# EAGLE design NeuWatch (EAGLE 7.2.0)

## Sheet 1 of 3
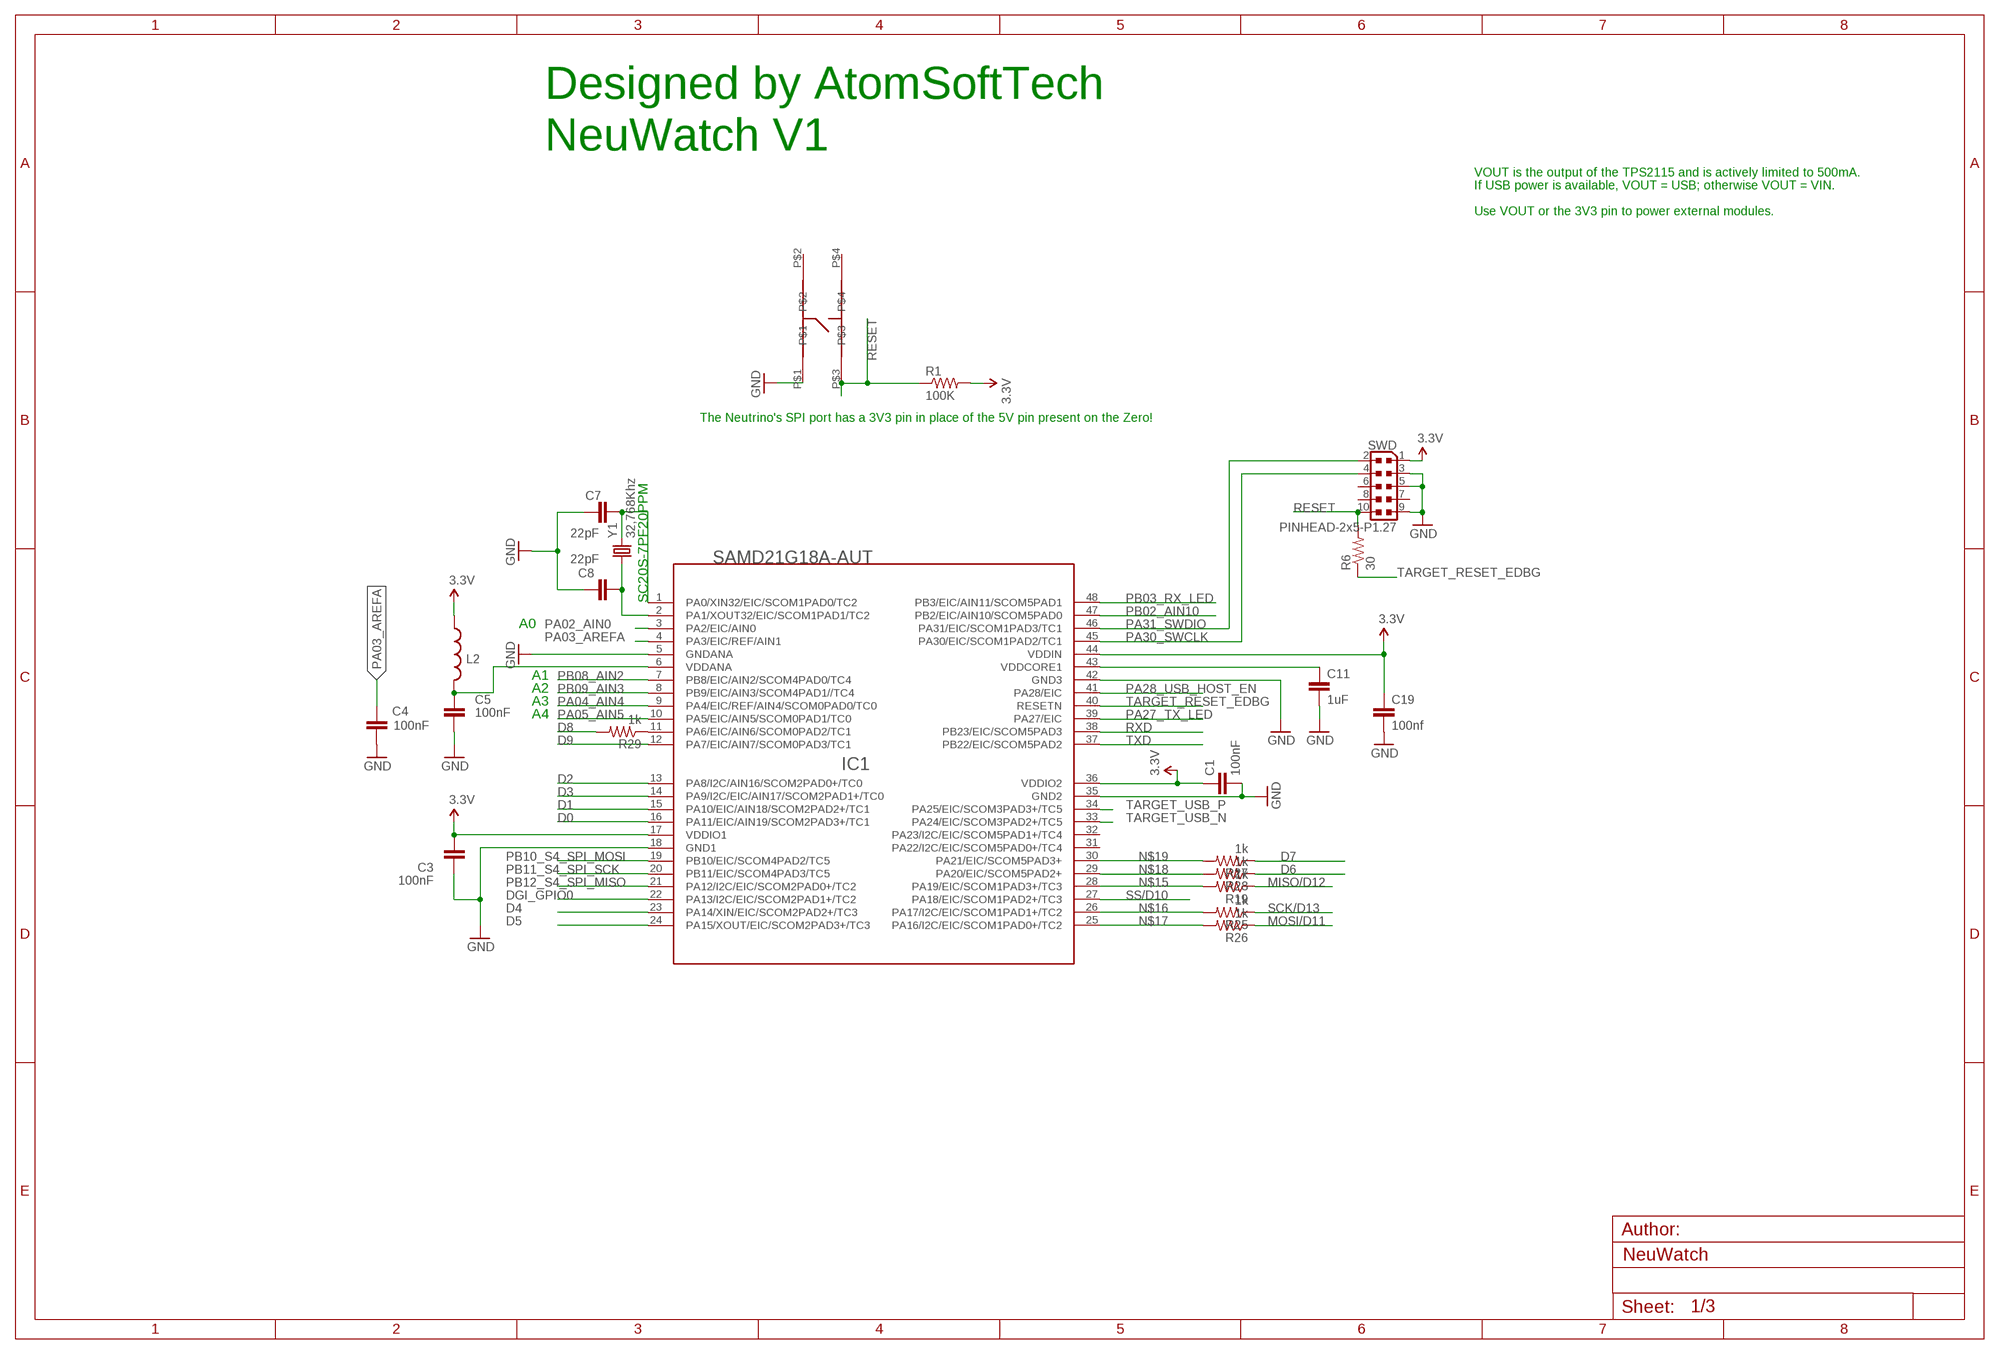
[diagram p0: schematic, sheet 1]

### Parts
C1  100nF  CAPACITORC0402  [C0402]
C3  100nF  CAPACITORC0402  [C0402]
C4  100nF  CAPACITORC0402  [C0402]
C5  100nF  CAPACITORC0402  [C0402]
C7  22pF  CAPACITORC0402  [C0402]
C8  22pF  CAPACITORC0402  [C0402]
C11  1uF  CAPACITORC0402  [C0402]
C19  100nf  CAPACITORC0402  [C0402]
IC1  SAMD21G18A-AUT  INTEGRATEDCIRCUITS_1792_SAMD21G18A-AUT  [INTEGRATEDCIRCUITS_TQFP48-7X7]
L2  INDUCTOR0603-TDK  [0603-TDK]
R1  100K  R-US_R0402  [R0402]
R6  30  R-US_R0402  [R0402]
R19  1k  R-US_R0402  [R0402]
R25  1k  R-US_R0402  [R0402]
R26  1k  R-US_R0402  [R0402]
R27  1k  R-US_R0402  [R0402]
R28  1k  R-US_R0402  [R0402]
R29  1k  R-US_R0402  [R0402]
RESET  TACTILE_SWITCH  [PTS540]
SWD  PINHEAD-2x5-P1.27  ARDUINO-NEUTRINO-082_CONNETTORI_0171_PH127-205DF055G00A  [ARDUINO-NEUTRINO-082_CONNETTORI_PINHEAD-2X5-P127]
Y1  32,768Khz  CRYSTAL2012  [CRYSTAL-SMD-2.0X1.2]

### Nets
3.3V: C1.1 C3.2 C19.1 IC1.17(VDDIO1) IC1.36(VDDIO2) IC1.44(VDDIN) L2.1 R1.2 SWD.1 ; also sheet 2,3
D0: IC1.16(PA11/EIC/AIN19/SCOM2PAD3+/TC1) ; also sheet 3
D1: IC1.15(PA10/EIC/AIN18/SCOM2PAD2+/TC1) ; also sheet 3
D2: IC1.13(PA8/I2C/AIN16/SCOM2PAD0+/TC0) ; also sheet 3
D3: IC1.14(PA9/I2C/EIC/AIN17/SCOM2PAD1+/TC0) ; also sheet 3
D4: IC1.23(PA14/XIN/EIC/SCOM2PAD2+/TC3) ; also sheet 3
D5: IC1.24(PA15/XOUT/EIC/SCOM2PAD3+/TC3) ; also sheet 3
D6: R28.1 ; also sheet 3
D7: R27.1 ; also sheet 3
D8: R29.2 ; also sheet 3
D9: IC1.12(PA7/EIC/AIN7/SCOM0PAD3/TC1) ; also sheet 3
DGI_GPIO0: IC1.22(PA13/I2C/EIC/SCOM2PAD1+/TC2)
GND [gnd]: C1.2 C3.1 C4.2 C5.2 C7.1 C8.1 C11.2 C19.2 IC1.5(GNDANA) IC1.18(GND1) IC1.35(GND2) IC1.42(GND3) RESET.P$1 SWD.3 SWD.5 SWD.9 ; also sheet 2,3
MISO/D12: R19.1 ; also sheet 3
MOSI/D11: R26.1 ; also sheet 3
N$15: IC1.28(PA19/EIC/SCOM1PAD3+/TC3) R19.2
N$16: IC1.26(PA17/I2C/EIC/SCOM1PAD1+/TC2) R25.2
N$17: IC1.25(PA16/I2C/EIC/SCOM1PAD0+/TC2) R26.2
N$18: IC1.29(PA20/EIC/SCOM5PAD2+) R28.2
N$19: IC1.30(PA21/EIC/SCOM5PAD3+) R27.2
N$20: IC1.11(PA6/EIC/AIN6/SCOM0PAD2/TC1) R29.1
PA00_XIN32: C7.2 IC1.1(PA0/XIN32/EIC/SCOM1PAD0/TC2) Y1.2
PA01_XOUT32: C8.2 IC1.2(PA1/XOUT32/EIC/SCOM1PAD1/TC2) Y1.1
PA02_AIN0: IC1.3(PA2/EIC/AIN0) ; also sheet 3
PA03_AREFA: C4.1 IC1.4(PA3/EIC/REF/AIN1)
PA04_AIN4: IC1.9(PA4/EIC/REF/AIN4/SCOM0PAD0/TC0) ; also sheet 3
PA05_AIN5: IC1.10(PA5/EIC/AIN5/SCOM0PAD1/TC0) ; also sheet 3
PA27_TX_LED: IC1.39(PA27/EIC)
PA28_USB_HOST_EN: IC1.41(PA28/EIC) ; also sheet 2
PA30_SWCLK: IC1.45(PA30/EIC/SCOM1PAD2/TC1) SWD.4
PA31_SWDIO: IC1.46(PA31/EIC/SCOM1PAD3/TC1) SWD.2
PB02_AIN10: IC1.47(PB2/EIC/AIN10/SCOM5PAD0) ; also sheet 3
PB03_RX_LED: IC1.48(PB3/EIC/AIN11/SCOM5PAD1)
PB08_AIN2: IC1.7(PB8/EIC/AIN2/SCOM4PAD0/TC4) ; also sheet 3
PB09_AIN3: IC1.8(PB9/EIC/AIN3/SCOM4PAD1//TC4) ; also sheet 3
PB10_S4_SPI_MOSI: IC1.19(PB10/EIC/SCOM4PAD2/TC5)
PB11_S4_SPI_SCK: IC1.20(PB11/EIC/SCOM4PAD3/TC5)
PB12_S4_SPI_MISO: IC1.21(PA12/I2C/EIC/SCOM2PAD0+/TC2)
RESET: R1.1 R6.2 RESET.P$3 SWD.10
RXD: IC1.38(PB23/EIC/SCOM5PAD3)
SCK/D13: R25.1 ; also sheet 3
SS/D10: IC1.27(PA18/EIC/SCOM1PAD2+/TC3) ; also sheet 3
TARGET_RESET_EDBG: IC1.40(RESETN) R6.1
TARGET_USB_N: IC1.33(PA24/EIC/SCOM3PAD2+/TC5) ; also sheet 2
TARGET_USB_P: IC1.34(PA25/EIC/SCOM3PAD3+/TC5) ; also sheet 2
TXD: IC1.37(PB22/EIC/SCOM5PAD2)
VDDANA: C5.1 IC1.6(VDDANA) L2.2
VDDCORE: C11.1 IC1.43(VDDCORE1)
Unconnected: IC1.31(PA22/I2C/EIC/SCOM5PAD0+/TC4) IC1.32(PA23/I2C/EIC/SCOM5PAD1+/TC4) RESET.P$2 RESET.P$4 SWD.6 SWD.7 SWD.8

### Notes on the sheet
- Designed by AtomSoftTech
- NeuWatch V1
- VOUT is the output of the TPS2115 and is actively limited to 500mA.
- If USB power is available, VOUT = USB; otherwise VOUT = VIN.
- Use VOUT or the 3V3 pin to power external modules.
- The Neutrino's SPI port has a 3V3 pin in place of the 5V pin present on the Zero!
- SC20S-7PF20PPM
- A0
- A1
- A2
- A3
- A4

## Sheet 2 of 3
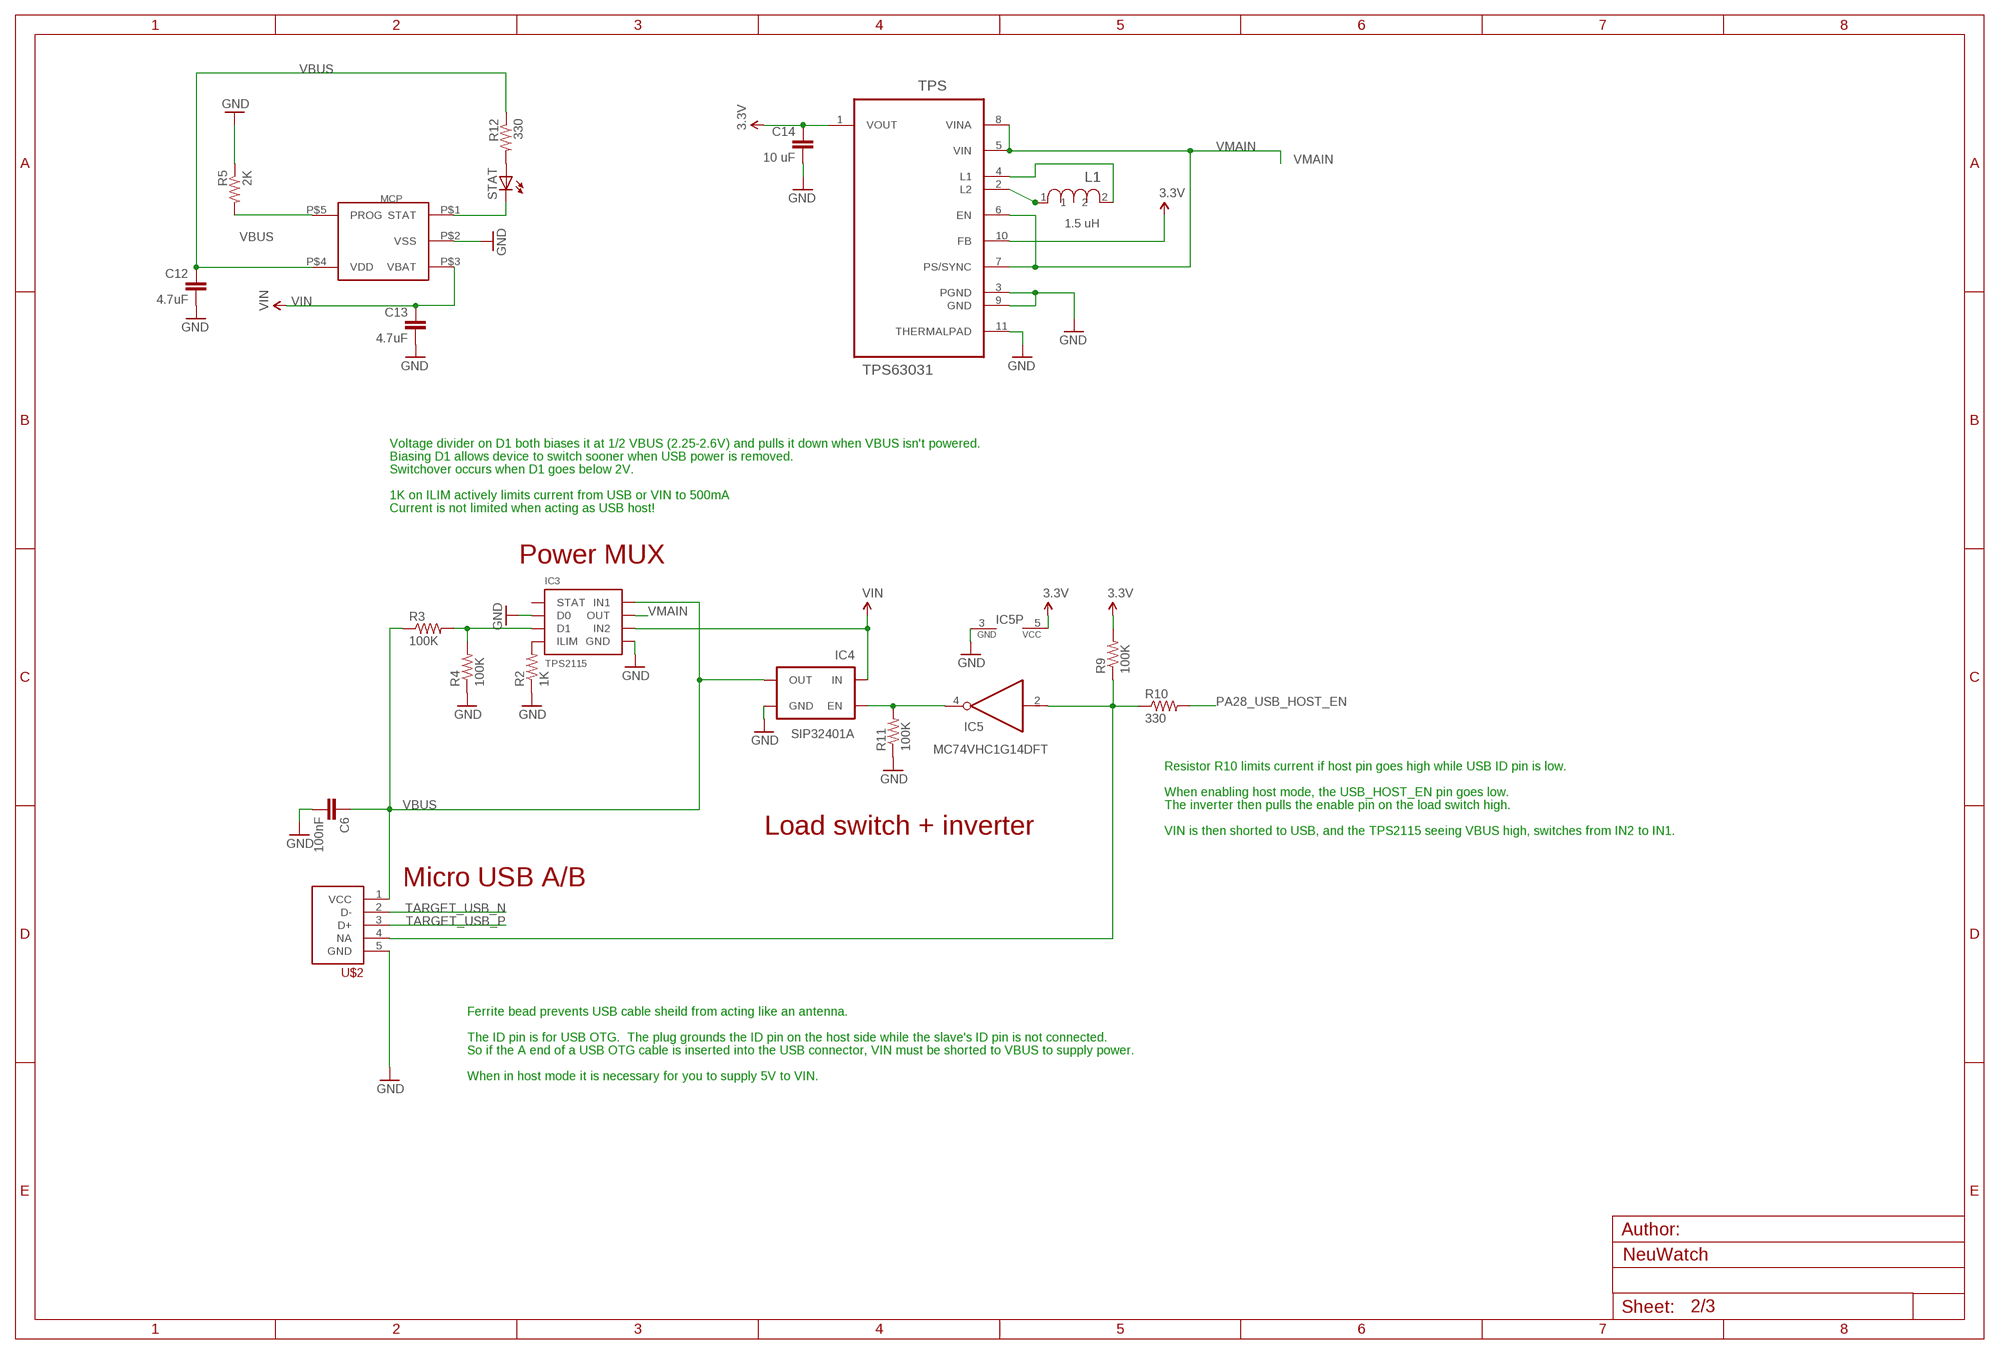
[diagram p1: schematic, sheet 2]

### Parts
C6  100nF  CAPACITORC0402  [C0402]
C12  4.7uF  CAPACITORC0402  [C0402]
C13  4.7uF  CAPACITORC0402  [C0402]
C14  10 uF  CAPACITORC0402  [C0402]
IC3  TPS2115  [8-VDFN]
IC4  SIP32401A  [TDFN4]
IC5  MC74VHC1G14DFT  74AHC1G04DCK  [SC70-5]
L1  1.5 uH  PM0603-R12J-RC  [INDC1610X12N]
MCP  MCP73831  [5PIN_SOT23]
R2  1K  R-US_R0402  [R0402]
R3  100K  R-US_R0402  [R0402]
R4  100K  R-US_R0402  [R0402]
R5  2K  R-US_R0402  [R0402]
R9  100K  R-US_R0402  [R0402]
R10  330  R-US_R0402  [R0402]
R11  100K  R-US_R0402  [R0402]
R12  330  R-US_R0402  [R0402]
STAT  LEDSML0603  [SML0603]
TPS  TPS63031  [SON50P260X260X80-11N]
U$2  USB_GENERIC_CHEAT  [1LFS]

### Nets
3.3V: C14.1 IC5.5(VCC) R9.2 TPS.1(VOUT) TPS.10(FB) ; also sheet 1,3
DATT1: IC3.3(D1) R3.2 R4.2
GND [gnd]: C6.2 C12.2 C13.2 C14.2 IC3.2(D0) IC3.5(GND) IC3.P0(GND) IC3.V0(GND) IC3.V1(GND) IC3.V2(GND) IC3.V3(GND) IC3.V4(GND) IC4.0(GND) IC4.2(GND) IC5.3(GND) MCP.P$2(VSS) R2.1 R4.1 R5.1 R11.1 TPS.3(PGND) TPS.9(GND) TPS.11(THERMALPAD) U$2.5(GND) ; also sheet 1,3
IC4_EN: IC4.4(EN) IC5.4(O) R11.2
ILIM: IC3.4(ILIM) R2.2
N$1: L1.1 TPS.2(L2)
N$2: MCP.P$1(STAT) STAT.C
N$3: MCP.P$5(PROG) R5.2
N$4: R12.2 STAT.A
N$6: L1.2 TPS.4(L1)
N$7: IC5.2(I) R9.1 R10.1 U$2.4(NA)
PA28_USB_HOST_EN: R10.2 ; also sheet 1
TARGET_USB_N: U$2.2(D-) ; also sheet 1
TARGET_USB_P: U$2.3(D+) ; also sheet 1
VBUS [usbvcc]: C6.1 C12.1 IC3.8(IN1) IC4.1(OUT) MCP.P$4(VDD) R3.1 R12.1 U$2.1(VCC)
VIN [usbvcc]: C13.1 IC3.6(IN2) IC4.3(IN) MCP.P$3(VBAT) ; also sheet 3
VMAIN: IC3.7(OUT) TPS.5(VIN) TPS.6(EN) TPS.7(PS/SYNC) TPS.8(VINA)
Unconnected: IC3.1(STAT)

### Notes on the sheet
- Voltage divider on D1 both biases it at 1/2 VBUS (2.25-2.6V) and pulls it down when VBUS isn't powered.
- Biasing D1 allows device to switch sooner when USB power is removed.
- Switchover occurs when D1 goes below 2V.
- 1K on ILIM actively limits current from USB or VIN to 500mA
- Current is not limited when acting as USB host!
- Power MUX
- Resistor R10 limits current if host pin goes high while USB ID pin is low.
- When enabling host mode, the USB_HOST_EN pin goes low.
- The inverter then pulls the enable pin on the load switch high.
- Load switch + inverter | VIN is then shorted to USB, and the TPS2115 seeing VBUS high, switches from IN2 to IN1.
- Micro USB A/B
- Ferrite bead prevents USB cable sheild from acting like an antenna.
- The ID pin is for USB OTG.  The plug grounds the ID pin on the host side while the slave's ID pin is not connected.
- So if the A end of a USB OTG cable is inserted into the USB connector, VIN must be shorted to VBUS to supply power.
- When in host mode it is necessary for you to supply 5V to VIN.

## Sheet 3 of 3
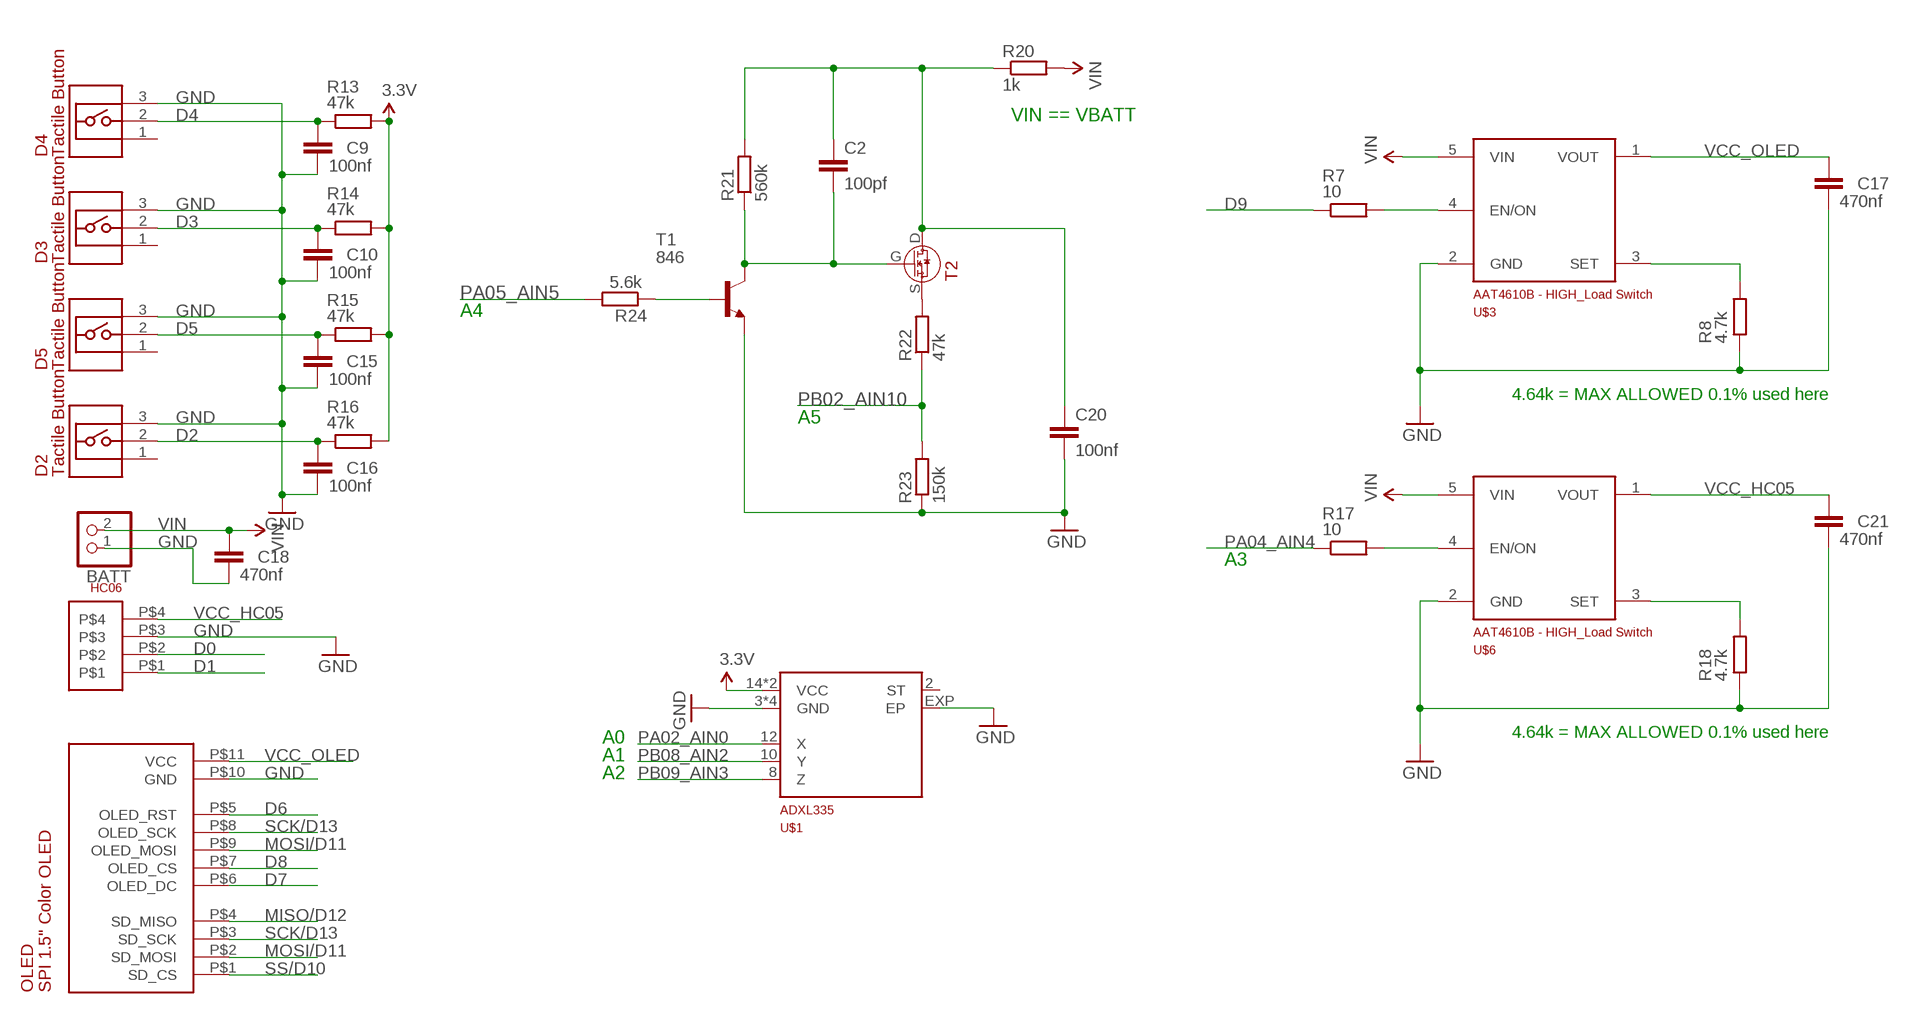
[diagram p2: schematic, sheet 3]

### Parts
BATT  PINHD-1X2  [1X02]
C2  100pf  CAPACITORC0402  [C0402]
C9  100nf  CAPACITORC0402  [C0402]
C10  100nf  CAPACITORC0402  [C0402]
C15  100nf  CAPACITORC0402  [C0402]
C16  100nf  CAPACITORC0402  [C0402]
C17  470nf  CAPACITORC0402  [C0402]
C18  470nf  CAPACITORC0402  [C0402]
C20  100nf  CAPACITORC0402  [C0402]
C21  470nf  CAPACITORC0402  [C0402]
D2  BUTTON_P0  [P021301]
D3  BUTTON_P0  [P021301]
D4  BUTTON_P0  [P021301]
D5  BUTTON_P0  [P021301]
HC06  1X4  [1B4]
OLED  1.5-OLED  [1.5OLED]
R7  10  R-EU_R0402  [R0402]
R8  4.7k  R-EU_R0402  [R0402]
R13  47k  R-EU_R0402  [R0402]
R14  47k  R-EU_R0402  [R0402]
R15  47k  R-EU_R0402  [R0402]
R16  47k  R-EU_R0402  [R0402]
R17  10  R-EU_R0402  [R0402]
R18  4.7k  R-EU_R0402  [R0402]
R20  1k  R-EU_R0402  [R0402]
R21  560k  R-EU_R0402  [R0402]
R22  47k  R-EU_R0402  [R0402]
R23  150k  R-EU_R0402  [R0402]
R24  5.6k  R-EU_R0402  [R0402]
T1  846  BC846BLT1-NPN-SOT23-BEC  [SOT23-BEC]
T2  2N7002  2N7002_ALT  [MOSFET]
U$1  ADXL335  [16LFCSP]
U$3  AAT4610B  [SOT23-5]
U$6  AAT4610B  [SOT23-5]

### Nets
3.3V: R13.2 R14.2 R15.2 R16.2 U$1.14(VCC) U$1.15(VCC) ; also sheet 1,2
D0: HC06.P$2 ; also sheet 1
D1: HC06.P$1 ; also sheet 1
D2: C16.1 D2.2 R16.1 ; also sheet 1
D3: C10.1 D3.2 R14.1 ; also sheet 1
D4: C9.1 D4.2 R13.1 ; also sheet 1
D5: C15.1 D5.2 R15.1 ; also sheet 1
D6: OLED.P$5(OLED_RST) ; also sheet 1
D7: OLED.P$6(OLED_DC) ; also sheet 1
D8: OLED.P$7(OLED_CS) ; also sheet 1
D9: R7.1 ; also sheet 1
GND [gnd]: BATT.1 C9.2 C10.2 C15.2 C16.2 C17.2 C18.2 C20.2 C21.2 D2.3 D3.3 D4.3 D5.3 HC06.P$3 OLED.P$10(GND) R8.1 R18.1 R23.1 T1.E U$1.3(GND) U$1.5(GND) U$1.6(GND) U$1.7(GND) U$1.EXP(EP) U$3.2(GND) U$6.2(GND) ; also sheet 1,2
MISO/D12: OLED.P$4(SD_MISO) ; also sheet 1
MOSI/D11: OLED.P$2(SD_MOSI) OLED.P$9(OLED_MOSI) ; also sheet 1
N$5: C2.2 R21.1 T1.C T2.G
N$8: R24.1 T1.B
N$9: C2.1 C20.1 R20.1 R21.2 T2.D
N$10: R7.2 U$3.4(EN/ON)
N$11: R8.2 U$3.3(SET)
N$12: R17.2 U$6.4(EN/ON)
N$13: R18.2 U$6.3(SET)
N$14: R22.2 T2.S
PA02_AIN0: U$1.12(X) ; also sheet 1
PA04_AIN4: R17.1 ; also sheet 1
PA05_AIN5: R24.2 ; also sheet 1
PB02_AIN10: R22.1 R23.2 ; also sheet 1
PB08_AIN2: U$1.10(Y) ; also sheet 1
PB09_AIN3: U$1.8(Z) ; also sheet 1
SCK/D13: OLED.P$3(SD_SCK) OLED.P$8(OLED_SCK) ; also sheet 1
SS/D10: OLED.P$1(SD_CS) ; also sheet 1
VCC_HC05: C21.1 HC06.P$4 U$6.1(VOUT)
VCC_OLED: C17.1 OLED.P$11(VCC) U$3.1(VOUT)
VIN [usbvcc]: BATT.2 C18.1 R20.2 U$3.5(VIN) U$6.5(VIN) ; also sheet 2
Unconnected: D2.1 D3.1 D4.1 D5.1 U$1.2(ST)

### Notes on the sheet
- VIN == VBATT
- A4
- 4.64k = MAX ALLOWED 0.1% used here
- A5
- A3
- 4.64k = MAX ALLOWED 0.1% used here
- A0
- A1
- A2

## Library data of the parts
BATT = pinhead:PINHD-1X2: PIN HEADER
C1-C21 = AtomTech:CAPACITOR: CAPACITOR, European symbol
D2-D5 = AtomTech:BUTTON_P0
HC06 = AtomTech:1X4
IC1 = Arduino-Neutrino-082:INTEGRATEDCIRCUITS_1792_SAMD21G18A-AUT: Atmel D21 32bit ARM Cortex-M0 microcontroller - 48 PIN TQFP 256KB flash memory + 32KB SRAM
IC3 = swift:TPS2115
IC4 = swift:SIP32401A
IC5 = 74xx-little-us:74*1G04: INVERTER Gate
L1 = Bourns_By_element14_Batch_1:PM0603-R12J-RC: CHIP INDUCTOR, 120NH, 300MA, 5%, 1300MHZ; MPN: PM0603-R12J-RC; OC_FARNELL: -; OC_NEWARK: 86K1771; SUPPLIER: BOURNS; TOLERANCE: ±5 %; VALUE: 120 nH
L2 = SparkFun-Passives:INDUCTOR: Inductors Basic Inductor/Choke - 0603 and 1206. Footprints are not proven and vary greatly between part numbers. SRN6045- 33uH, 20% 1.4A SDR0403-560KL - 56uH, 10%, 500mA RMS/740mA peak
MCP = parts:MCP73831: Digikey No:- __MCP73831T-2ACI/OTCT-ND__
OLED = AtomTech:1.5-OLED
R1-R4 R6 R9-R11 R19 R25-R29 = adafruit:R-US_: RESISTOR, American symbol
R5 R12 = rcl:R-US_: RESISTOR, American symbol
R7 R8 R13-R18 R20-R24 = rcl:R-EU_: RESISTOR, European symbol
RESET = AtomTech:TACTILE_SWITCH: Ultra Low Profile SMT Top Actuated PTS540 JM035 SMTR LFS Datasheet <http://www.mouser.com/ds/2/60/PTS540_9sept14-372441.pdf>
STAT = led:LED: LED OSRAM: - CHIPLED LG R971, LG N971, LY N971, LG Q971, LY Q971, LO R971, LY R971 LH N974, LH R974 LS Q976, LO Q976, LY Q976 LO Q996 - Hyper CHIPLED LW Q18S LB Q993, LB Q99A, LB R99A - SideLED LS A670, LO A670, LY A670, LG A670, LP A670 LB A673, LV A673, LT A673, LW A673 LH A674 LY A675 LS A676, LA A676, LO A676, LY A676, LW A676 LS A679, LY A679, LG A679 - Hyper Micro SIDELED® LS Y876, LA Y876, LO Y876, LY Y876 LT Y87S - SmartLED LW L88C, LW L88S LB L89C, LB L89S, LG L890 LS L89K, LO L89K, LY L89K LS L896, LA L896, LO L896, LY L896 - TOPLED LS T670, LO T670, LY T670, LG T670, LP T670 LSG T670, LSP T670, LSY T670, LOP T670, LYG T670 LG T671, LOG T671, LSG T671 LB T673, LV T673, LT T673, LW T673 LH T674 LS T676, LA T676, LO T676, LY T676, LB T676, LH T676, LSB T676, LW T676 LB T67C, LV T67C, LT T67C, LS T67K, LO T67K, LY T67K, LW E67C LS E67B, LA E67B, LO E67B, LY E67B, LB E67C, LV E67C, LT E67C LW T67C LS T679, LY T679, LG T679 LS T770, LO T770, LY T770, LG T770, LP T770 LB T773, LV T773, LT T773, LW T773 LH T774 LS E675, LA E675, LY E675, LS T675 LS T776, LA T776, LO T776, LY T776, LB T776 LHGB T686 LT T68C, LB T68C - Hyper Mini TOPLED® LB M676 - Mini TOPLED Santana® LG M470 LS M47K, LO M47K, LY M47K Source: http://www.osram.convergy.de LUXEON: - LUMILED® LXK2-PW12-R00, LXK2-PW12-S00, LXK2-PW14-U00, LXK2-PW14-V00 LXK2-PM12-R00, LXK2-PM12-S00, LXK2-PM14-U00 LXK2-PE12-Q00, LXK2-PE12-R00, LXK2-PE12-S00, LXK2-PE14-T00, LXK2-PE14-U00 LXK2-PB12-K00, LXK2-PB12-L00, LXK2-PB12-M00, LXK2-PB14-N00, LXK2-PB14-P00, LXK2-PB14-Q00 LXK2-PR12-L00, LXK2-PR12-M00, LXK2-PR14-Q00, LXK2-PR14-R00 LXK2-PD12-Q00, LXK2-PD12-R00, LXK2-PD12-S00 LXK2-PH12-R00, LXK2-PH12-S00 LXK2-PL12-P00, LXK2-PL12-Q00, LXK2-PL12-R00 Source: www.luxeon.com KINGBRIGHT: KA-3528ASYC Source: www.kingbright.com
SWD = Neutrino-:ARDUINO-NEUTRINO-082_CONNETTORI_0171_PH127-205DF055G00A: 2x5 PASSO 1,27
T1 = transistor:*-NPN-: NPN Transistror BF959 corrected 2008.03.06
T2 = AtomTech:2N7002_ALT
TPS = Texas Instruments_By_element14_Batch_1:TPS63031: HIGH EFFICIENCY SINGLE INDUCTOR BUCK-BOOST CONVERTER WITH 1-A SWITCHES; MPN: TPS63031; OC_FARNELL: 1686303; OC_NEWARK: 19P7478; PACKAGE: SON-10; SUPPLIER: Texas Instruments
U$1 = AtomTech:ADXL335
U$2 = AtomTech:USB_GENERIC
U$3 U$6 = AtomTech:AAT4610B
Y1 = SparkFun-FreqCtrl:CRYSTAL: Various standard crystals. Proven footprints. Spark Fun Electronics SKU : COM-00534

## Net classes
0 default: width 0.254 mm, drill 0.33 mm, clearance 0.178 mm
1 USB: width 0.152 mm, drill 0.305 mm, clearance 0.152 mm
2 gnd: width 0.152 mm, drill 0.305 mm, clearance 0.152 mm
3 usbvcc: width 0.152 mm, drill 0.305 mm, clearance 0.152 mm
4 USBpair: width 0.152 mm, drill 0.305 mm, clearance 0.152 mm

## Board
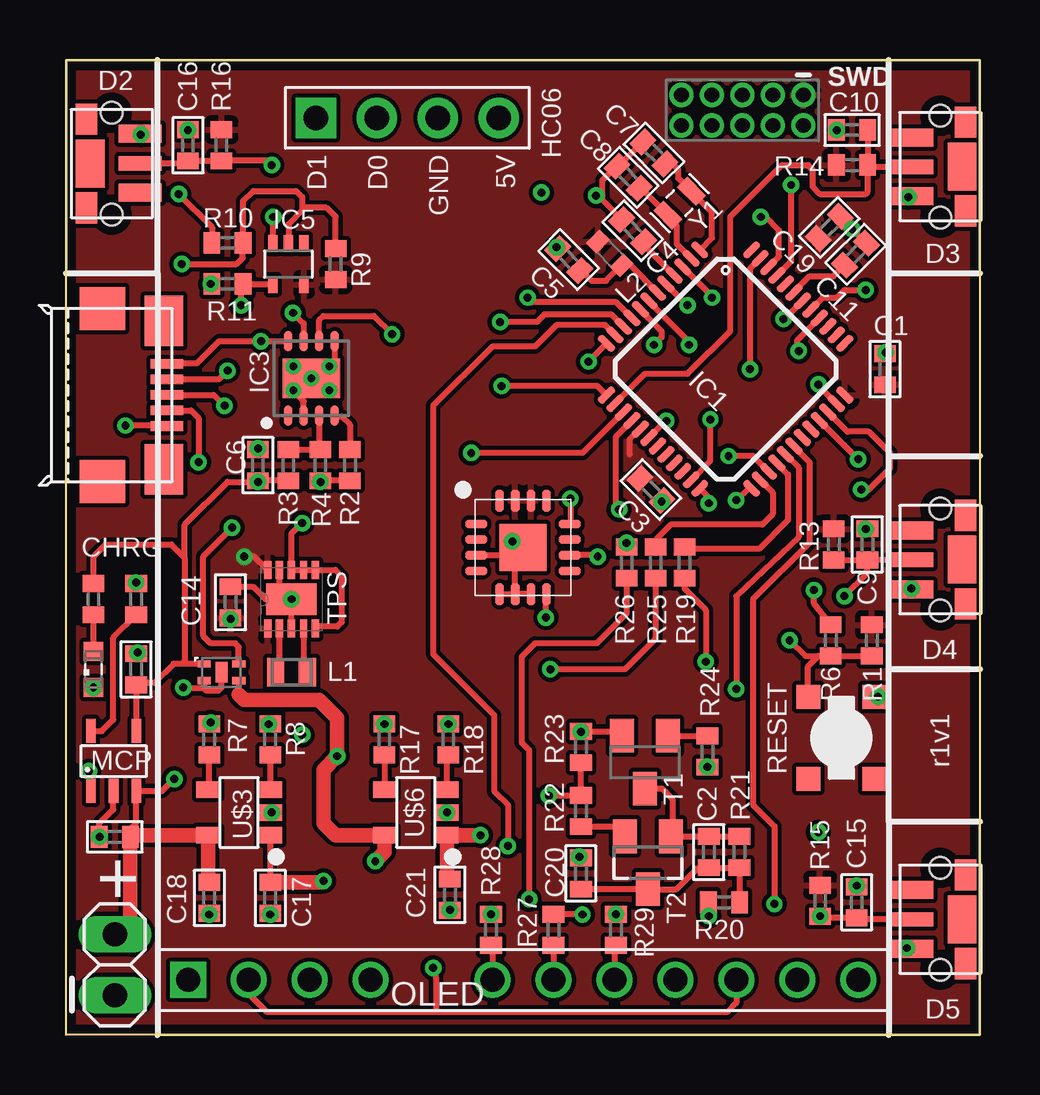
[diagram p3: board, top side]
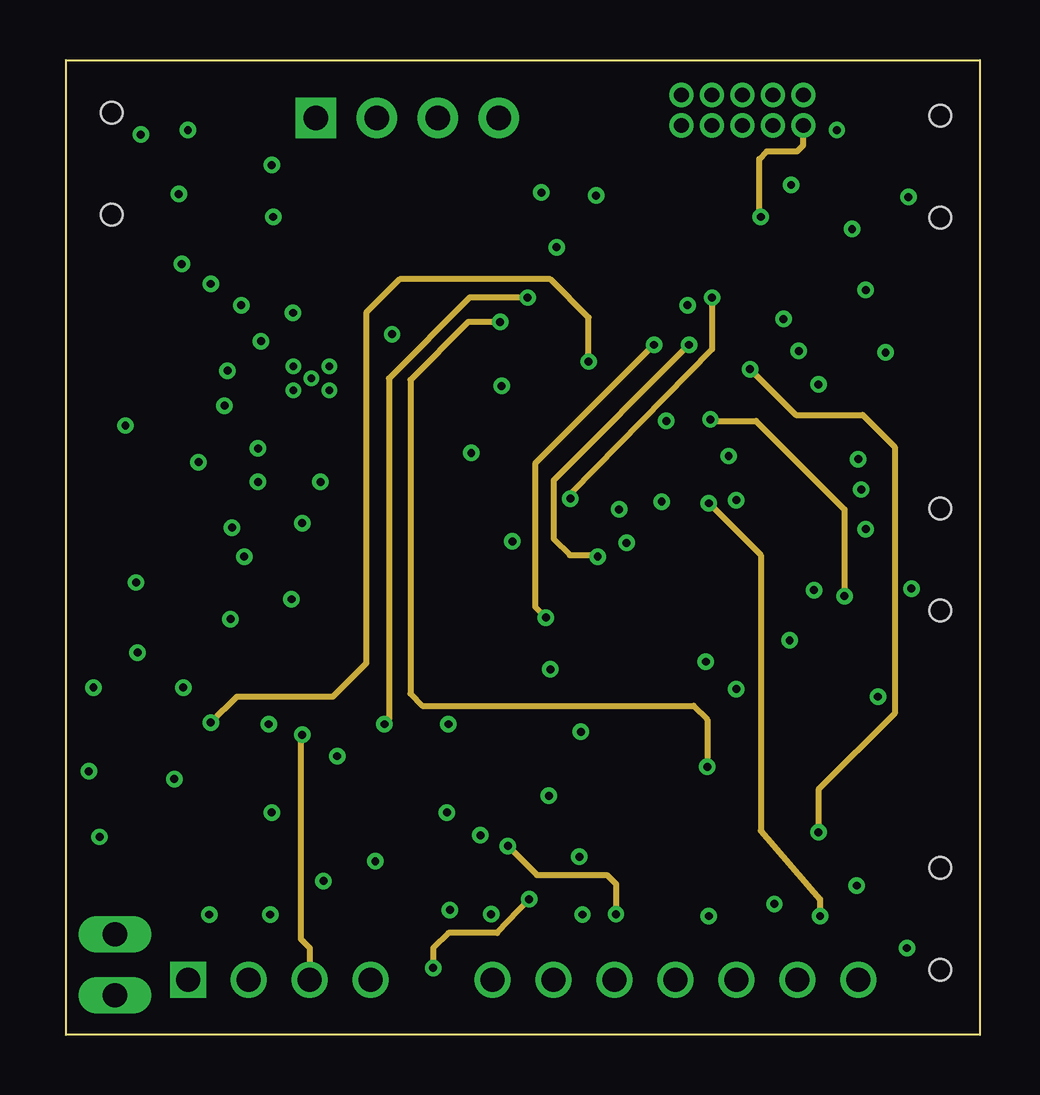
[diagram p4: board, inner layer Route2]
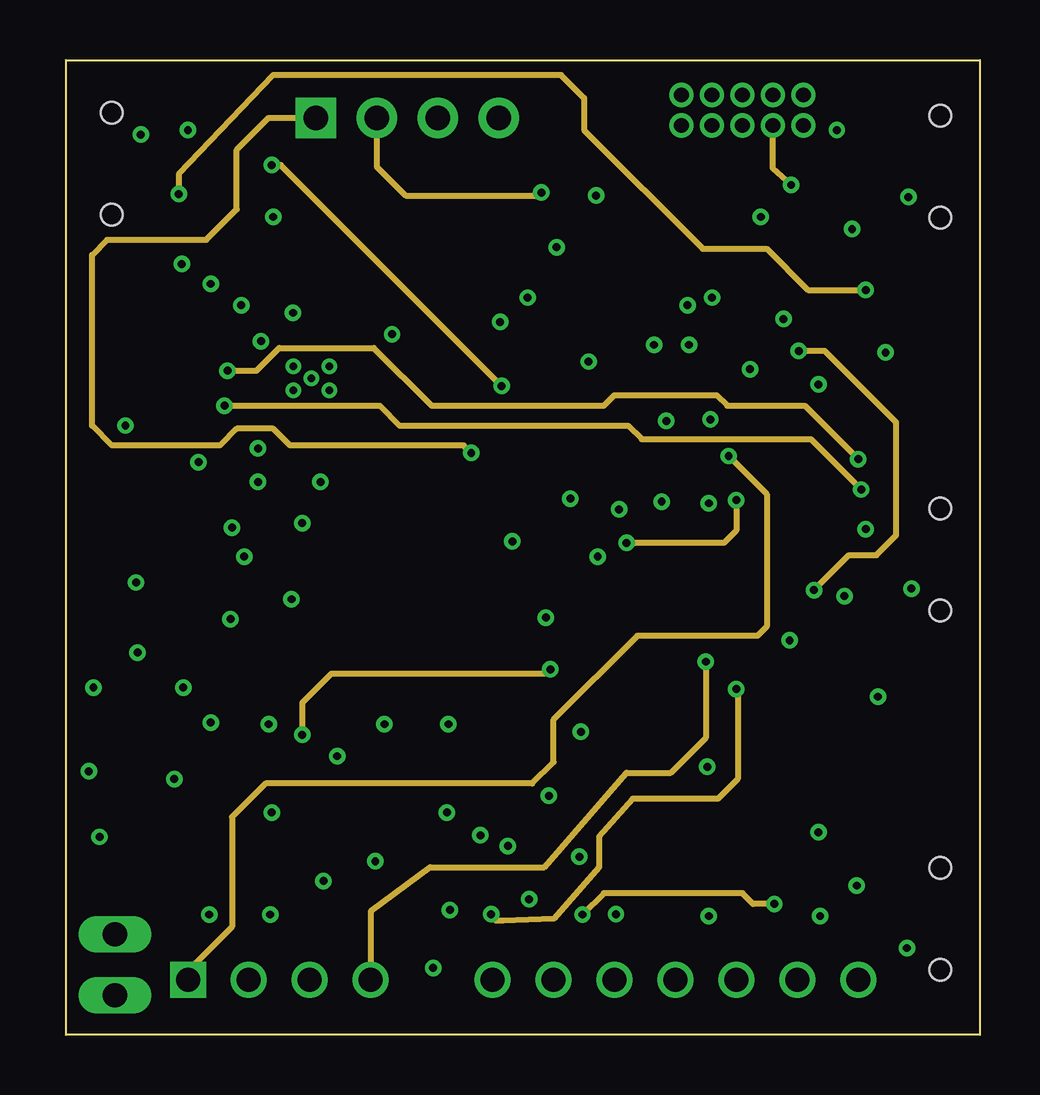
[diagram p5: board, inner layer Route15]
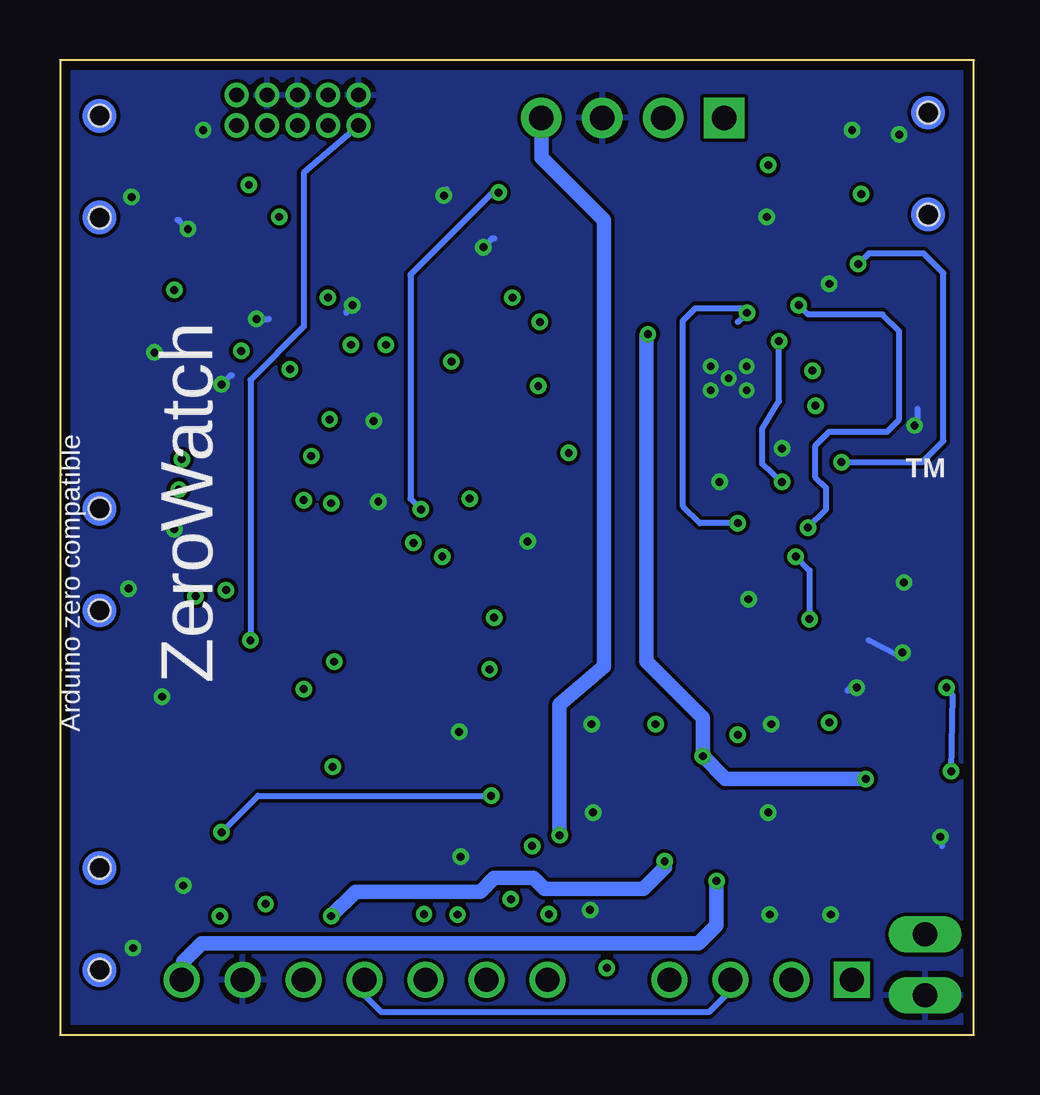
[diagram p6: board, bottom side, seen from below]

Size 38.1 x 40.64 mm. Coordinates in mm from the lower left corner, seen from the top.
Outline: 38.1,40.64 38.1,0 0,0 0,40.64 38.1,40.64
Copper layers (1+2*15+16): Top 0.0356mm / dielectric 1.5011mm / Route2 0.0356mm / dielectric 0.1499mm / Route15 0.0356mm / dielectric 0.2007mm / Bottom 0.0356mm
Design rules "4LaenPCBOrder_maskoff *": minimum track width 6mil, minimum drill 13mil, track to track 6mil, track to pad 6mil, pad to pad 6mil, via to via 6mil, smd to smd 6mil, copper to edge 15mil, drill to drill 6mil, minimum pad ring 7mil, minimum via ring 7mil, stop-mask expansion 4mil, vias tented up to drill 14mil, thermal gap 10mil

### Footprints (pad centres in the part's own frame; a part is rotated, then mirrored left to right if it is on the bottom)
1X02 = drill 1.016 long: 1 -1.27,0; 2 1.27,0
C0402 = smd 0.7 x 0.9: 1 -0.65,0; 2 0.65,0
P021301 = smd 0.75 x 1.8: 1 1.21,1.19; 3 -1.24,1.19 | smd 0.6 x 1.8: 2 -0.01,1.19 | smd 2 x 1.2: P$3 0,-0.9 | smd 1.3 x 0.9: P$4 -1.85,-1.05; P$5 1.85,-1.05 | hole 0.9: 2.13,0; -2.12,0
1B4 = drill 1.016 pad 1.676 square: P$1 -3.81,0 | drill 1.016 pad 1.676: P$2 -1.27,0; P$3 1.27,0; P$4 3.81,0
INTEGRATEDCIRCUITS_TQFP48-7X7 = smd 0.85 x 0.32: 1 -4.275,2.75; 2 -4.275,2.25; 3 -4.275,1.75; 4 -4.275,1.25; 5 -4.275,0.75; 6 -4.275,0.25; 7 -4.275,-0.25; 8 -4.275,-0.75; 9 -4.275,-1.25; 10 -4.275,-1.75; 11 -4.275,-2.25; 12 -4.275,-2.75; 25 4.275,-2.75; 26 4.275,-2.25; 27 4.275,-1.75; 28 4.275,-1.25; 29 4.275,-0.75; 30 4.275,-0.25; 31 4.275,0.25; 32 4.275,0.75; 33 4.275,1.25; 34 4.275,1.75; 35 4.275,2.25; 36 4.275,2.75 | smd 0.32 x 0.85: 13 -2.75,-4.275; 14 -2.25,-4.275; 15 -1.75,-4.275; 16 -1.25,-4.275; 17 -0.75,-4.275; 18 -0.25,-4.275; 19 0.25,-4.275; 20 0.75,-4.275; 21 1.25,-4.275; 22 1.75,-4.275; 23 2.25,-4.275; 24 2.75,-4.275; 37 2.75,4.275; 38 2.25,4.275; 39 1.75,4.275; 40 1.25,4.275; 41 0.75,4.275; 42 0.25,4.275; 43 -0.25,4.275; 44 -0.75,4.275; 45 -1.25,4.275; 46 -1.75,4.275; 47 -2.25,4.275; 48 -2.75,4.275
8-VDFN = smd 0.35 x 0.85: 1 -0.975,-1.545; 2 -0.325,-1.545; 3 0.325,-1.545; 4 0.975,-1.545; 5 0.975,1.545; 6 0.325,1.545; 7 -0.325,1.545; 8 -0.975,1.545 | smd 2.4 x 1.65: P0 0,0 | drill 0.305 pad 0.61: V0 -0.75,0.5; V1 0.75,0.5; V2 0,0; V3 -0.75,-0.5; V4 0.75,-0.5
TDFN4 = smd 0.86 x 0.5: 0 0,0 | smd 0.3 x 0.55: 1 -0.35,-0.725; 2 0.35,-0.725; 3 0.35,0.725; 4 -0.35,0.725
SC70-5 = smd 0.4 x 0.7: 1 -0.65,-0.85; 2 0,-0.85; 3 0.65,-0.85; 4 0.65,0.85; 5 -0.65,0.85
INDC1610X12N = smd 0.711 x 1.194: 1 -0.66,0; 2 0.66,0
0603-TDK = smd 0.6 x 0.8: 1 -0.7,0; 2 0.7,0
5PIN_SOT23 = smd 0.4 x 1: P$1 0.4,-0.63; P$2 1.35,-0.63; P$3 2.3,-0.63; P$4 2.3,1.87; P$5 0.4,1.87
1.5OLED = drill 1 square: P$1 0,0 | drill 1: P$2 2.54,0; P$3 5.08,0; P$4 7.62,0; P$5 12.7,0; P$6 15.24,0; P$7 17.78,0; P$8 20.32,0; P$9 22.86,0; P$10 25.4,0; P$11 27.94,0
R0402 = smd 0.7 x 0.9: 1 -0.65,0; 2 0.65,0
PTS540 = smd 1 x 1: P$1 -1.712,1.375; P$2 1.712,1.375; P$3 -1.712,-1.375; P$4 1.712,-1.375
SML0603 = smd 0.8 x 0.8: A 0.75,0; C -0.75,0
ARDUINO-NEUTRINO-082_CONNETTORI_PINHEAD-2X5-P127 = drill 0.61 pad 1.016: 1 -0.635,2.54; 2 0.635,2.54; 3 -0.635,1.27; 4 0.635,1.27; 5 -0.635,0; 6 0.635,0; 7 -0.635,-1.27; 8 0.635,-1.27; 9 -0.635,-2.54; 10 0.635,-2.54
SOT23-BEC = smd 1 x 1.4: B -0.95,-1.1; C 0,1.1; E 0.95,-1.1
MOSFET = smd 1 x 1.4: D 0,1.1; G -0.95,-1.1; S 0.95,-1.1
SON50P260X260X80-11N = smd 0.762 x 0.305: 1 -1.219,0.991; 2 -1.219,0.508; 3 -1.219,0; 4 -1.219,-0.508; 5 -1.219,-0.991; 6 1.219,-0.991; 7 1.219,-0.508; 8 1.219,0; 9 1.219,0.508; 10 1.219,0.991 | smd 1.295 x 2.108: 11 0,0
16LFCSP = smd 0.9 x 0.35: 1 -1.95,0.975; 2 -1.95,0.325; 3 -1.95,-0.325; 4 -1.95,-0.975; 9 1.95,-0.975; 10 1.95,-0.325; 11 1.95,0.325; 12 1.95,0.975 | smd 0.35 x 0.9: 5 -0.975,-1.95; 6 -0.325,-1.95; 7 0.325,-1.95; 8 0.975,-1.95; 13 0.975,1.95; 14 0.325,1.95; 15 -0.325,1.95; 16 -0.975,1.95 | smd 1.95 x 1.95: EXP 0,0
1LFS = smd 0.4 x 1.35: 1 -1.31,2.68; 2 -0.66,2.68; 3 -0.01,2.68; 4 0.64,2.68; 5 1.29,2.68 | smd 1.8 x 1.9: P$3 -3.6,0; P$4 3.6,0 | smd 2.1 x 1.6: P$10 -3.1,2.55; P$11 3.1,2.56
SOT23-5 = smd 0.69 x 0.99: 1 -0.95,0; 2 0,0; 3 0.95,0; 4 0.95,2.59; 5 -0.95,2.59
CRYSTAL-SMD-2.0X1.2 = smd 0.6 x 1.1: 1 -0.7,0; 2 0.7,0

### Placement (x,y rotation side)
BATT  2.03,2.92 90 top
C1  34.14,27.75 90 top
C2  26.8,7.62 90 top
C3  24.38,22.73 135 top
C4  23.62,33.53 135 top
C5  20.95,32.32 135 top
C6  8,23.75 90 top
C7  24.51,36.77 315 top
C8  23.43,35.75 315 top
C9  33.4,20.45 90 top
C10  32.77,37.72 180 top
C11  32.91,32.54 45 top
C12  2.92,15.24 90 top
C13  2.03,8.26 180 top
C14  6.86,18.03 90 top
C15  32.96,5.52 90 top
C16  5.08,37.08 90 top
C17  8.51,5.71 270 top
C18  5.97,5.71 270 top
C19  31.81,33.66 45 top
C20  21.46,6.73 90 top
C21  16,5.84 270 top
D2  1.9,36.32 270 top
D3  36.45,36.2 90 top
D4  36.45,19.81 90 top
D5  36.45,4.83 90 top
HC06  14.22,38.23 0 top
IC1  27.5,27.75 315 top
IC3  10.22,27.37 0 top
IC4  6.48,15.11 270 top
IC5  9.27,32.13 180 top
L1  9.4,15.11 0 top
L2  22.67,32.58 315 top
MCP  0.64,10.79 0 top
OLED  5.08,2.29 0 top
R1  33.59,16.45 90 top
R2  11.84,23.75 90 top
R3  9.27,23.75 90 top
R4  10.6,23.75 90 top
R5  2.92,18.16 270 top
R6  31.88,16.45 270 top
R7  5.97,12.32 270 top
R8  8.51,12.32 270 top
R9  11.24,32.13 270 top
R10  6.73,33.02 180 top
R11  6.73,31.31 0 top
R12  1.14,18.16 270 top
R13  32,20.45 90 top
R14  32.77,36.26 180 top
R15  31.43,5.59 90 top
R16  6.48,37.08 90 top
R17  13.27,12.32 270 top
R18  15.94,12.32 270 top
R19  25.78,19.68 90 top
R20  27.43,5.52 180 top
R21  28.07,7.62 270 top
R22  21.46,9.33 270 top
R23  21.46,12 270 top
R24  26.73,11.81 270 top
R25  24.57,19.68 90 top
R26  23.37,19.68 90 top
R27  20.32,4.38 90 top
R28  17.72,4.38 90 top
R29  22.92,4.38 270 top
RESET  32.32,12.38 270 top
STAT  1.14,15.24 90 top
SWD  28.19,38.54 270 top
T1  24.13,11.37 180 top
T2  24.26,7.18 180 top
TPS  9.4,18.16 90 top
U$1  19.05,20.32 0 top
U$2  1.52,26.67 270 top
U$3  8.51,9.27 90 top
U$6  15.88,9.27 90 top
Y1  25.58,34.67 45 top

### Tracks (layer width: path | path; a pad name or v marks a point on that pad's centre or on a via)
3.3V  (via drill 0.33)
  Top 0.254: IC1.17 23.92,25.26 23.5,24.83 23.5,24.19 | TPS.10 7.85,19.94 v7.43,19.94 | v6.86,17.34 C14.1
  Bottom 0.254: v7.43,19.94 6.86,19.37 v6.86,17.34
  pour Top: -1.27,-2.16 -1.27,41.91 38.86,41.91 38.86,-2.16
D0  (via drill 0.33)
  Top 0.254: v23.05,21.91 22.92,21.91 22.92,24.95 IC1.16
  Route15 0.254: HC06.P$2 12.95,36.2 14.16,34.99 19.68,34.99 v19.81,35.12
  Bottom 0.254: v19.81,35.12 20.07,35.12 23.5,31.69 23.5,22.35 v23.05,21.91
D1  (via drill 0.33)
  Top 0.254: IC1.15 21.53,24.26 v16.89,24.26
  Route15 0.254: v16.89,24.26 16.57,24.57 9.33,24.57 8.64,25.27 7.11,25.27 6.41,24.57 1.9,24.57 1.08,25.4 1.08,32.51 1.72,33.15 5.84,33.15 7.11,34.42 7.11,36.89 8.45,38.23 HC06.P$1
D2  (via drill 0.33)
  Top 0.254: D2.2 4.98,36.33 C16.1 R16.1 8.4,36.43 v8.57,36.26 | IC1.13 22.15,27.05 v18.16,27.05
  Route15 0.254: v18.16,27.05 8.95,36.26 v8.57,36.26
D3
  Top 0.254: IC1.14 24.12,27.56 25.91,27.56 27.69,29.34 27.69,34.1 29.85,36.26 30.92,36.26 31.11,36.07 31.11,35.37 31.43,35.05 33.34,35.05 33.42,35.13 R14.1 | C10.1 R14.1 | R14.1 33.49,36.19 D3.2
D4  (via drill 0.33)
  Top 0.254: D4.2 C9.1 | R13.1 C9.1 | IC1.23 26.86,23.93 v26.86,25.65 | v32.45,18.29 33.4,19.24 C9.1
  Route2 0.254: v26.86,25.65 26.92,25.59 28.77,25.59 32.45,21.91 v32.45,18.29
D5  (via drill 0.33)
  Top 0.254: D5.2 33.02,4.82 C15.1 31.5,4.88 R15.1 31.42,5.07 v31.43,4.95 | IC1.24 26.8,22.4 v26.8,22.16
  Route2 0.254: v26.8,22.16 28.96,20 28.96,8.51 31.43,5.65 v31.43,4.95
D6
  Top 0.254: R28.1 17.78,3.67 OLED.P$5
D7
  Top 0.254: R27.1 OLED.P$6
D8
  Top 0.254: R29.2 22.86,3.67 OLED.P$7
D9  (via drill 0.33)
  Top 0.254: IC1.12 22.53,28.82 v21.78,28.07 | v6.03,13.02 6.02,13.02 R7.1
  Route2 0.254: v21.78,28.07 21.78,29.91 20.19,31.5 13.91,31.5 12.51,30.1 12.51,15.49 11.11,14.1 7.11,14.1 v6.03,13.02
DATT1
  Top 0.254: R3.2 R4.2 10.54,24.4 IC3.3
GND  (via drill 0.33)
  Top 0.254: TPS.9 8.89,18.67 TPS.11 | C14.2 7.8,18.68 8.32,18.16 TPS.11 | U$1.5 U$1.6 | U$1.6 18.73,19.94 | 18.73,19.94 18.73,20 18.7,20.1 | 18.7,20.1 v18.61,20.57 | U$1.7 U$1.6 | U$1.3 18.67,20 18.73,19.94 | IC1.18 25.05,25.65 v25.02,25.59 | IC1.5 25.89,30.42 v25.91,30.42 | C7.1 23.04,36.21 C8.1 22.94,36.21 22.35,35.62 22.35,34.8 | C4.2 22.35,34.8 | C5.2 v20.45,32.83 | 22.35,34.8 22.16,34.99 v22.1,34.99 | IC1.42 29.94,29.84 v29.91,29.84 | IC1.35 31.37,27.06 v31.37,27.11 | C1.2 34.19,28.45 v34.16,28.45 | C11.2 32.78,33.59 v32.77,33.59 32.77,33.63 C19.2 | U$2.5 4.18,25.4 v2.48,25.4 | IC3.2 9.91,26.42 9.47,26.85 IC3.V3 | C6.2 v8,24.45 | R2.1 R4.1 v10.61,23.05 | MCP.P$2 1.97,10.15 1.97,9.4 1.38,8.81 C13.2 1.38,8.05 v1.4,8.26 | C12.2 3.06,15.95 v2.98,15.94 | R5.1 3,18.81 v2.92,18.86 | TPS.3 TPS.11 | v5.97,5.02 C18.2 | v8.51,5.02 C17.2 | v21.4,7.43 21.41,7.43 C20.2 | T1.E 23,12.65 R23.1 v21.46,12.64 | C15.2 v32.96,6.22 | v35.05,3.62 35.23,3.62 D5.3 | v32.13,37.72 C10.2 | D3.3 35.15,34.95 v35.12,34.92 | v33.34,21.08 33.39,21.08 C9.2 | D4.3 35.26,18.59 v35.24,18.61 | IC3.5 11.2,28.09 IC3.V1 | v3.11,37.53 3.11,37.55 D2.3 | v5.08,37.72 C16.2 | IC5.3 8.62,34.08 v8.64,34.1 | v6.03,31.3 R11.1 | C21.2 v16,5.21 | v15.94,12.95 R18.1 | IC4.2 5.75,14.44 | 5.75,14.44 5.84,14.35 6.35,14.35 6.48,14.48 IC4.0 | 5.75,14.44 4.93,14.44 v4.89,14.48 | C3.1 24.84,22.24 v24.83,22.23 | RESET.P$1 v33.85,14.1 | R8.1 8.49,12.95 v8.45,12.95 | v8.57,9.27 U$3.2 | U$1.EXP 18.83,20.1 18.7,20.1
  Bottom 0.254: v25.02,25.59 25.08,25.72 25.21,25.72 | v25.91,30.42 26.16,30.16 26.16,30.1 | v20.45,32.83 20.07,33.21 20,33.21 | v22.1,34.99 21.97,35.12 21.97,35.24 | v29.91,29.84 29.4,29.84 | v31.37,27.11 30.99,27.5 30.92,27.5 | v34.16,28.45 34.35,28.45 | v32.77,33.59 33.15,33.97 33.21,33.97 | v2.48,25.4 2.35,25.53 2.35,26.1 | v1.4,8.26 1.33,7.87 | v4.89,14.48 5.14,14.48 5.27,14.35 | v2.98,15.94 3.18,15.81 4.38,16.45 | 3.11,18.8 v2.92,18.86
  other vias: 9.4,18.16 15.88,9.27
  pour Bottom: 38.86,-2.16 38.86,41.91 -1.27,41.91 -1.27,-2.16
IC4_EN  (via drill 0.33)
  Top 0.254: IC5.4 7.41,31.28 R11.2 7.3,31.23 v7.3,30.42 | IC4.4 7.2,16.17 7.05,16.32 6.03,16.32 5.71,16.64 5.71,19.94 v6.92,21.14
  Bottom 0.254: v6.92,21.14 6.16,21.91 6.16,22.8 6.6,23.24 6.6,24.57 6.03,25.15 3.62,25.15 3.11,25.65 3.11,29.34 3.81,30.04 6.92,30.04 v7.3,30.42
ILIM
  Top 0.254: IC3.4 11.24,25.78 11.49,25.78 11.84,25.44 R2.2
MISO/D12  (via drill 0.33)
  Top 0.254: v26.67,15.56 26.67,17.72 25.78,18.61 R19.1
  Route15 0.254: v26.67,15.56 26.67,12.38 25.21,10.92 23.37,10.92 19.94,6.99 15.18,6.99 12.7,5.14 OLED.P$4
MOSI/D11  (via drill 0.33)
  Top 0.254: OLED.P$9 27.94,1.33 27.56,0.95 15.43,0.95 | 15.43,0.95 8.38,0.95 7.56,1.78 7.56,2.22 OLED.P$2 | v19.3,5.65 19.3,11.87 18.99,12.19 18.99,15.75 19.56,16.32 22.11,16.32 23.37,17.58 R26.1 | v15.3,2.79 15.43,2.35 15.43,0.95
  Route2 0.254: v19.3,5.65 17.97,4.25 15.94,4.25 15.3,3.62 v15.3,2.79
N$1
  Top 0.254: TPS.2 8.89,15.27 L1.1
N$2  (via drill 0.33)
  Top 0.254: MCP.P$1 0.97,11.01 v0.95,10.99 | v1.14,14.48 STAT.C
  Bottom 0.254: v0.95,10.99 0.89,14.16 v1.14,14.48
N$3
  Top 0.254: MCP.P$5 1.49,12.66 1.97,13.14 1.97,16.56 R5.2
N$4
  Top 0.254: STAT.A R12.2
N$5
  Top 0.254: T1.C 24.85,10.27 25.27,9.84 25.27,8.34 T2.G C2.2 R21.1
N$6
  Top 0.254: TPS.4 9.91,15.27 L1.2
N$7  (via drill 0.33)
  Top 0.254: 9.84,34.48 9.84,34.92 9.59,35.18 7.81,35.18 7.38,34.75 R10.1 7.37,33.01 7.37,32.38 7.11,32.13 v4.83,32.13 | 9.84,34.48 9.84,34.35 9.27,33.78 IC5.2 | R9.1 11.24,34.1 10.86,34.48 9.84,34.48 | U$2.4 5.21,26.03 5.53,25.72 v5.53,23.88
  Bottom 0.254: v5.53,23.88 2.16,23.88 1.27,24.77 1.27,31.75 2.1,32.58 4.38,32.58 v4.83,32.13
N$8
  Top 0.254: T1.B R24.1
N$9
  Top 0.254: C20.1 T2.D 25.44,6.08 26.29,6.92 26.75,6.92 C2.1 R21.2 28.07,5.54 R20.1
N$10
  Top 0.254: U$3.4 5.97,10.27 R7.2
N$11
  Top 0.254: R8.2 U$3.3
N$12
  Top 0.254: R17.2 13.27,10.23 U$6.4
N$13
  Top 0.254: U$6.3 15.88,11.61 R18.2
N$14
  Top 0.254: R22.2 22.9,8.68 T2.S
N$15
  Top 0.254: IC1.28 30.1,23.37 30.1,21.46 28.89,20.26 25.86,20.26 R19.2
N$16
  Top 0.254: IC1.26 29.46,22.61 29.46,21.72 29.02,21.27 25.21,21.27 24.64,20.7 24.64,20.4 R25.2
N$17  (via drill 0.33 pad 0.51)
  Top 0.254: IC1.25 28.43,22.78 v27.94,22.29 | v23.37,20.51 R26.2
  Route15 0.254: v27.94,22.29 27.94,21.02 27.43,20.51 v23.37,20.51
N$18  (via drill 0.33 pad 0.51)
  Top 0.254: IC1.29 30.54,23.64 30.54,20.77 27.94,18.29 v27.94,14.41 | 17.72,5.27 R28.2
  Route15 0.254: v27.94,14.41 28,14.35 28,10.67 27.18,9.84 23.62,9.84 22.23,8.26 22.23,6.99 20.34,4.84 18.22,4.76 17.98,4.76 arc-90 R28.2
  other vias: 17.72,5.03
N$19  (via drill 0.33 pad 0.51)
  Top 0.254: IC1.30 30.34,24.52 30.99,23.88 30.99,20.51 28.64,18.16 28.64,9.59 29.53,8.7 v29.53,5.46 | v21.53,5.02 20.34,5.02 R27.2
  Route15 0.254: v29.53,5.46 28.64,5.46 28.19,5.91 22.41,5.91 v21.53,5.02
N$20  (via drill 0.33 pad 0.51)
  Top 0.254: IC1.11 22.47,29.59 20.45,29.59 19.56,28.7 17.78,28.7 15.3,26.23 15.3,15.88 17.84,13.34 17.84,10.16 18.41,9.59 v18.41,7.87 | R29.1 23,4.95 22.92,5.02 23.04,4.97 R29.1
  Route2 0.254: v18.41,7.87 19.62,6.67 22.54,6.67 22.92,6.29 R29.1
  other vias: 22.92,5.03
PA00_XIN32
  Top 0.254: IC1.1 26.92,33.22 26.92,34.29 26.07,35.14 Y1.2 25.53,35.71 25.53,36.07 25.16,36.43 C7.2
PA01_XOUT32
  Top 0.254: IC1.2 25.46,32.96 25.46,33.72 25.08,34.1 Y1.1 23.97,35.29 C8.2
PA02_AIN0  (via drill 0.33)
  Top 0.254: IC1.3 26.86,30.86 27.05,30.8 v26.92,30.73 | v21.02,22.35 21.02,21.31 U$1.12
  Route2 0.254: v26.92,30.73 26.92,28.57 21.08,22.61 21.08,22.42 v21.02,22.35
PA03_AREFA
  Top 0.254: IC1.4 24.08,32.93 C4.1
PA04_AIN4  (via drill 0.33)
  Top 0.254: IC1.9 23.59,29.88 22.92,30.54 19.43,30.54 v19.24,30.73 | v13.27,12.95 R17.1
  Route2 0.254: v19.24,30.73 16.83,30.73 13.46,27.37 13.46,13.14 v13.27,12.95
PA05_AIN5  (via drill 0.33)
  Top 0.254: IC1.10 22.73,30.04 19.94,30.04 19.62,29.72 v18.1,29.72 | v26.73,11.18 R24.2
  Route2 0.254: v18.1,29.72 16.76,29.72 14.35,27.3 14.35,14.22 14.86,13.72 26.16,13.72 26.73,13.14 v26.73,11.18
PA28_USB_HOST_EN  (via drill 0.33)
  Top 0.254: IC1.41 31.54,30.73 32.13,30.73 32.45,31.05 v33.34,31.05 | v4.7,35.05 6.08,33.67 R10.2
  Route15 0.254: v4.7,35.05 4.7,35.88 8.64,40.01 20.64,40.01 21.59,39.05 21.59,37.72 26.54,32.77 29.21,32.77 30.92,31.05 v33.34,31.05
PA30_SWCLK  (via drill 0.33)
  Top 0.254: IC1.45 30.23,32.25 v30.23,35.43
  Route15 0.254: v30.23,35.43 29.46,36.13 SWD.4
PA31_SWDIO  (via drill 0.33)
  Top 0.254: IC1.46 29.72,32.45 29.72,33.53 29.15,34.1 v28.96,34.1
  Route2 0.254: v28.96,34.1 28.89,34.23 28.89,36.51 29.21,36.83 30.48,36.83 30.73,37.08 SWD.2
PB02_AIN10  (via drill 0.33)
  Top 0.254: R23.2 R22.1 20.14,9.98 v20.13,9.97 | IC1.47 28.51,31.95 v28.51,27.75
  Route2 0.254: v28.51,27.75 30.42,25.84 33.21,25.84 34.54,24.51 34.54,13.4 31.37,10.22 v31.37,8.45
  Bottom 0.254: v31.37,8.45 29.85,9.97 v20.13,9.97
PB08_AIN2  (via drill 0.33)
  Top 0.254: IC1.7 24.3,30.57 25.84,29.02 v25.97,28.77 | v22.16,19.94 22.1,20 U$1.10
  Route2 0.254: v25.97,28.77 20.32,23.11 20.32,20.68 U$1.10 22.11,20 v22.16,19.94
PB09_AIN3  (via drill 0.33)
  Top 0.254: IC1.8 23.94,30.22 24.83,29.34 24.83,29.08 v24.51,28.77 | v20,17.4 20,18.35 U$1.8
  Route2 0.254: v24.51,28.77 19.56,23.81 19.56,17.84 v20,17.4
RESET  (via drill 0.33)
  Top 0.254: R1.1 R6.2 31.35,15.8 | RESET.P$3 30.92,14.12 30.92,15.37 31.35,15.8 | v30.16,16.45 30.81,15.8 31.35,15.8
  Bottom 0.254: SWD.10 27.94,35.94 27.94,29.53 30.16,27.3 v30.16,16.45
SCK/D13  (via drill 0.33)
  Top 0.254: v20.19,15.24 23.3,15.24 24.57,16.51 R25.1
  Route2 0.254: v9.84,12.51 9.78,12.45 9.78,4 10.16,3.62 OLED.P$3
  Route15 0.254: v20.19,15.24 20,15.05 11.05,15.05 9.84,13.84 v9.84,12.51
  Bottom 0.254: OLED.P$3 10.16,1.84 11.05,0.95 24.7,0.95 25.46,1.71 25.46,2.22 OLED.P$8
SS/D10  (via drill 0.33)
  Top 0.254: IC1.27 28.64,24.13 v27.62,24.13
  Route15 0.254: v27.62,24.13 29.21,22.54 29.21,17.02 28.83,16.64 23.81,16.64 20.32,13.14 20.32,11.37 19.43,10.48 8.31,10.48 6.92,9.09 6.92,4.51 5.08,2.67 OLED.P$1
TARGET_RESET_EDBG  (via drill 0.33)
  Top 0.254: R6.1 31.18,17.98 v31.18,18.54 | v30.54,28.51 30.48,28.57 30.48,28.96 31.4,29.88 IC1.40
  Route15 0.254: v31.18,18.54 32.64,20 33.78,20 34.61,20.83 34.61,25.53 31.62,28.51 v30.54,28.51
TARGET_USB_N  (via drill 0.33)
  Top 0.254: U$2.2 6.38,27.33 v6.73,27.69 | v33.02,24 v33.01,24 IC1.33
  Route15 0.254: v6.73,27.69 7.94,27.69 8.89,28.64 12.83,28.64 15.24,26.23 22.41,26.23 22.86,26.67 27.11,26.67 27.56,26.23 30.8,26.23 v33.02,24
TARGET_USB_P  (via drill 0.33)
  Top 0.254: U$2.3 6.15,26.68 v6.6,26.23 | v33.15,22.73 33.46,22.73 34.35,23.62 34.35,24.26 33.46,25.15 32.57,25.15 IC1.34
  Route15 0.254: v6.6,26.23 13.08,26.23 13.91,25.4 23.43,25.4 24,24.83 31.05,24.83 v33.15,22.73
VBUS  (via drill 0.33)
  Top 0.254: U$2.1 4.23,28 5.46,28 6.37,28.91 v8.13,28.91 IC3.8 | R3.1 C6.1 7.95,23.05 v8,23.05 6.73,23.05 4.95,21.27 4.95,19.88 | MCP.P$4 2.94,14.58 C12.1 3,14.67 3.68,14.67 4.48,15.46 4.83,15.46 | IC4.1 4.83,15.46 | R12.1 1.14,19.94 1.65,20.45 4.38,20.45 4.95,19.88 | 4.95,19.88 4.95,15.59 4.83,15.46
  Bottom 0.254: v8,23.05 8.83,23.81 8.83,25.27 8.13,26.42 v8.13,28.91
VCC_HC05  (via drill 0.33)
  Top 0.254: 15.88,6.62 C21.1 | 17.21,8.32 v17.27,8.32
  Top 0.61: 15.88,6.62 U$6.1 17.21,8.32
  Bottom 0.61: v17.27,8.32 17.27,13.78 15.43,15.37 15.43,33.97 18.03,36.58 HC06.P$4
VCC_OLED  (via drill 0.33)
  Top 0.254: U$3.1 C17.1 | 10.68,6.37 v10.73,6.41
  Top 0.61: C17.1 10.68,6.37
  Bottom 0.254: 32.96,2.35 OLED.P$11
  Bottom 0.61: v10.73,6.41 10.73,4.57 11.49,3.81 32.2,3.81 32.96,3.05 32.96,2.35
VDDANA
  Top 0.254: IC1.6 23.52,32.08 L2.2 22.52,31.43 21.91,31.43 21.48,31.86 C5.1
VDDCORE
  Top 0.254: IC1.43 30.34,30.98 30.99,31.62 31.99,31.62 C11.1
VIN  (via drill 0.33, 0.33 pad 0.51)
  Top 0.254: BATT.2 2.68,4.84 | C13.1 2.75,8.32 2.75,8.65 2.92,8.83 2.92,10.15 MCP.P$3 4.01,10.16 v4.51,10.67 | C18.1 5.92,6.42 | IC3.6 10.55,29.79 10.73,29.97 12.83,29.97 v13.59,29.21 | IC4.3 7.2,14.2 | 13.27,8.31 U$6.5 | v26.8,4.95 R20.2
  Top 0.61: 2.68,4.84 C13.1 | 2.75,8.32 U$3.5 5.92,6.42 | 7.2,14.2 7.43,13.97 10.54,13.97 11.3,13.21 v11.3,11.62 10.73,11.05 10.73,8.83 11.24,8.32 U$6.5 | 13.27,8.31 13.27,7.62 v12.89,7.24
  Bottom 0.254: 13.65,29.15 v13.59,29.21 | v12.89,7.24 12.89,6.99
  Bottom 0.61: 13.65,29.15 13.65,15.56 11.3,13.21 v11.3,11.62 10.35,10.67 v4.51,10.67 | 12.89,6.99 13.78,6.1 17.91,6.1 18.35,6.54 20,6.54 20.57,5.97 25.78,5.97 v26.8,4.95
VMAIN  (via drill 0.33)
  Top 0.254: TPS.5 10.46,17.02 11.3,17.02 11.49,17.21 11.49,19.11 11.23,19.38 TPS.6 TPS.7 TPS.8 9.4,20.89 v9.84,21.34 | v9.46,30.1 9.91,29.65 IC3.7
  Bottom 0.254: 9.84,29.72 v9.46,30.1 9.65,30.29 11.62,30.29 12.13,29.78 12.13,22.04 11.43,21.34 v9.84,21.34

### Text on the board
tPlace: D1 | D0 | GND | 5V | CHRG | r1v1 | +
bPlace: ZeroWatch | TM | Arduino zero compatible
tValues: 22pf | 22pf | 100nf | L2 | 330 | 100nf | 100k | 1uf | 100nf | 100nf | 100nf | 100k | 330 | 100k | RED | MCP | AAT | AAT
214bmp: D:/SmartProjects/Snc/a4_bn_logo2.bmp